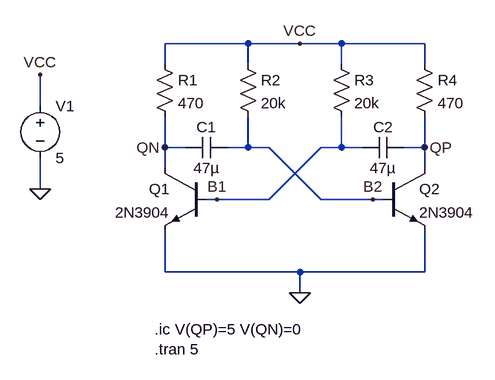
[diagram p0: schematic astable_npn.asc]
astable_npn.asc, the LTspice schematic file:
Version 4
SHEET 1 880 680
WIRE 160 -80 32 -80
WIRE 240 -80 160 -80
WIRE 304 -80 240 -80
WIRE 432 -80 304 -80
WIRE 32 -48 32 -80
WIRE 160 -48 160 -80
WIRE 304 -48 304 -80
WIRE 432 -48 432 -80
WIRE -160 16 -160 -32
WIRE 32 80 32 32
WIRE 64 80 32 80
WIRE 160 80 160 32
WIRE 160 80 128 80
WIRE 192 80 160 80
WIRE 304 80 304 32
WIRE 304 80 272 80
WIRE 336 80 304 80
WIRE 432 80 432 32
WIRE 432 80 400 80
WIRE 32 112 32 80
WIRE 432 112 432 80
WIRE -160 144 -160 96
WIRE 112 160 96 160
WIRE 192 160 272 80
WIRE 192 160 112 160
WIRE 272 160 192 80
WIRE 352 160 272 160
WIRE 368 160 352 160
WIRE 32 272 32 208
WIRE 240 272 32 272
WIRE 432 272 432 208
WIRE 432 272 240 272
WIRE 240 304 240 272
FLAG 240 304 0
FLAG 240 -80 VCC
FLAG 32 80 QN
FLAG 432 80 QP
FLAG -160 144 0
FLAG -160 -32 VCC
FLAG 112 160 B1
FLAG 352 160 B2
SYMBOL npn 96 112 M0
SYMATTR InstName Q1
SYMATTR Value 2N3904
SYMBOL npn 368 112 R0
SYMATTR InstName Q2
SYMATTR Value 2N3904
SYMBOL res 16 -64 R0
SYMATTR InstName R1
SYMATTR Value 470
SYMBOL res 144 -64 R0
SYMATTR InstName R2
SYMATTR Value 20k
SYMBOL res 288 -64 R0
SYMATTR InstName R3
SYMATTR Value 20k
SYMBOL res 416 -64 R0
SYMATTR InstName R4
SYMATTR Value 470
SYMBOL cap 128 64 R90
WINDOW 0 0 32 VBottom 2
WINDOW 3 32 32 VTop 2
SYMATTR InstName C1
SYMATTR Value 47µ
SYMBOL cap 400 64 R90
WINDOW 0 0 32 VBottom 2
WINDOW 3 32 32 VTop 2
SYMATTR InstName C2
SYMATTR Value 47µ
SYMBOL voltage -160 0 R0
WINDOW 123 0 0 Left 0
WINDOW 39 0 0 Left 0
SYMATTR InstName V1
SYMATTR Value 5
TEXT 16 360 Left 2 !.ic V(QP)=5 V(QN)=0\n.tran 5

The netlist it stands for:
* astable_npn.asc
Q1 QN B1 0 0 2N3904
Q2 QP B2 0 0 2N3904
R1 VCC QN 470
R2 VCC B2 20k
R3 VCC B1 20k
R4 VCC QP 470
C1 B2 QN 47µ
C2 QP B1 47µ
V1 VCC 0 5
.model NPN NPN
.model PNP PNP
.lib standard.bjt
.ic V(QP)=5 V(QN)=0
.tran 5
.backanno
.end